# EAGLE design General Switch Board V6 (EAGLE 6.3)
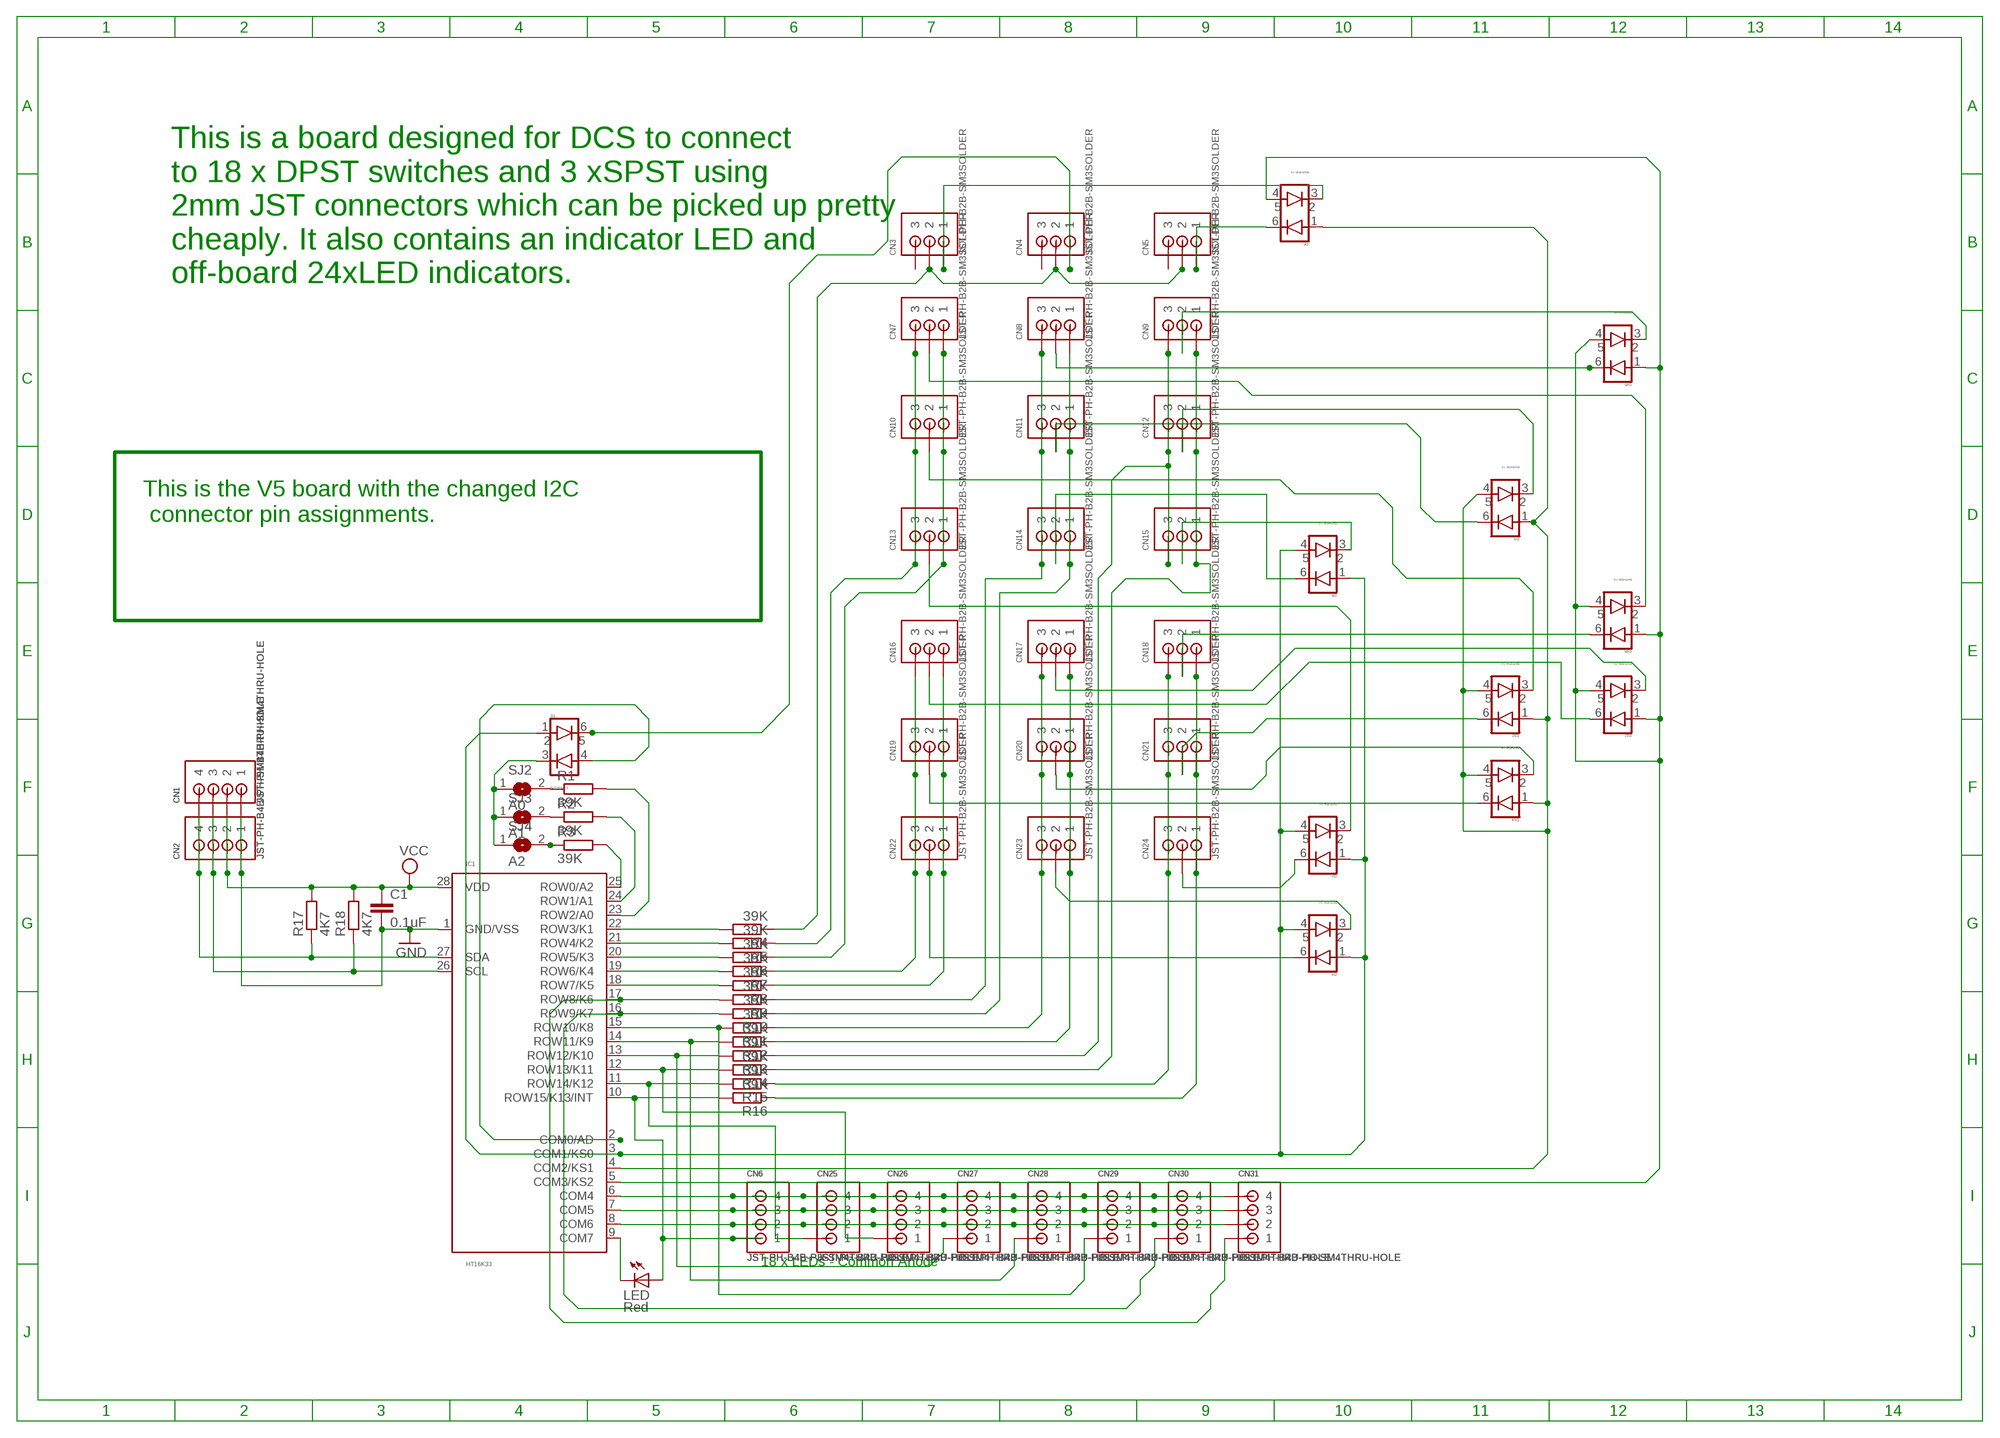
[diagram p0: schematic, sheet 1]

## Parts
C1  0.1uF  C-EUC0805  [C0805]
CN1  JST-PH-B4B-PH-SM4THRU-HOLE  [B4B-PH-SOLDER]
CN2  JST-PH-B4B-PH-SM4THRU-HOLE  [B4B-PH-SOLDER]
CN3  JST-PH-B2B-SM3SOLDER  [B3B-PH-SOLDER]
CN4  JST-PH-B2B-SM3SOLDER  [B3B-PH-SOLDER]
CN5  JST-PH-B2B-SM3SOLDER  [B3B-PH-SOLDER]
CN6  JST-PH-B4B-PH-SM4THRU-HOLE  [B4B-PH-SOLDER]
CN7  JST-PH-B2B-SM3SOLDER  [B3B-PH-SOLDER]
CN8  JST-PH-B2B-SM3SOLDER  [B3B-PH-SOLDER]
CN9  JST-PH-B2B-SM3SOLDER  [B3B-PH-SOLDER]
CN10  JST-PH-B2B-SM3SOLDER  [B3B-PH-SOLDER]
CN11  JST-PH-B2B-SM3SOLDER  [B3B-PH-SOLDER]
CN12  JST-PH-B2B-SM3SOLDER  [B3B-PH-SOLDER]
CN13  JST-PH-B2B-SM3SOLDER  [B3B-PH-SOLDER]
CN14  JST-PH-B2B-SM3SOLDER  [B3B-PH-SOLDER]
CN15  JST-PH-B2B-SM3SOLDER  [B3B-PH-SOLDER]
CN16  JST-PH-B2B-SM3SOLDER  [B3B-PH-SOLDER]
CN17  JST-PH-B2B-SM3SOLDER  [B3B-PH-SOLDER]
CN18  JST-PH-B2B-SM3SOLDER  [B3B-PH-SOLDER]
CN19  JST-PH-B2B-SM3SOLDER  [B3B-PH-SOLDER]
CN20  JST-PH-B2B-SM3SOLDER  [B3B-PH-SOLDER]
CN21  JST-PH-B2B-SM3SOLDER  [B3B-PH-SOLDER]
CN22  JST-PH-B2B-SM3SOLDER  [B3B-PH-SOLDER]
CN23  JST-PH-B2B-SM3SOLDER  [B3B-PH-SOLDER]
CN24  JST-PH-B2B-SM3SOLDER  [B3B-PH-SOLDER]
CN25  JST-PH-B4B-PH-SM4THRU-HOLE  [B4B-PH-SOLDER]
CN26  JST-PH-B4B-PH-SM4THRU-HOLE  [B4B-PH-SOLDER]
CN27  JST-PH-B4B-PH-SM4THRU-HOLE  [B4B-PH-SOLDER]
CN28  JST-PH-B4B-PH-SM4THRU-HOLE  [B4B-PH-SOLDER]
CN29  JST-PH-B4B-PH-SM4THRU-HOLE  [B4B-PH-SOLDER]
CN30  JST-PH-B4B-PH-SM4THRU-HOLE  [B4B-PH-SOLDER]
CN31  JST-PH-B4B-PH-SM4THRU-HOLE  [B4B-PH-SOLDER]
D1  BAT54TW-7-F  [SSOT6]
D2  BAT54TW-7-F  [SSOT6]
D3  BAT54TW-7-F  [SSOT6]
D4  BAT54TW-7-F  [SSOT6]
D5  BAT54TW-7-F  [SSOT6]
D6  BAT54TW-7-F  [SSOT6]
D13  BAT54TW-7-F  [SSOT6]
D14  BAT54TW-7-F  [SSOT6]
D15  BAT54TW-7-F  [SSOT6]
D16  BAT54TW-7-F  [SSOT6]
D17  BAT54TW-7-F  [SSOT6]
IC1  HT16K33  HOLTEK_HT16K33  [SOIC28]
LED  Red  LEDCHIPLED_1206  [CHIPLED_1206]
R1  39K  R-EU_R0805  [R0805]
R2  39K  R-EU_R0805  [R0805]
R3  39K  R-EU_R0805  [R0805]
R4  39K  R-EU_R0805  [R0805]
R5  39K  R-EU_R0805  [R0805]
R6  39K  R-EU_R0805  [R0805]
R7  39K  R-EU_R0805  [R0805]
R8  39K  R-EU_R0805  [R0805]
R9  39K  R-EU_R0805  [R0805]
R10  39K  R-EU_R0805  [R0805]
R11  39K  R-EU_R0805  [R0805]
R12  39K  R-EU_R0805  [R0805]
R13  39K  R-EU_R0805  [R0805]
R14  39K  R-EU_R0805  [R0805]
R15  39K  R-EU_R0805  [R0805]
R16  39K  R-EU_R0805  [R0805]
R17  4K7  R-EU_R0805  [R0805]
R18  4K7  R-EU_R0805  [R0805]
SJ2  A0  SJ  [SJ]
SJ3  A1  SJ  [SJ]
SJ4  A2  SJ  [SJ]

## Nets
GND: C1.2 CN1.P1 CN2.P1 IC1.1(GND/VSS)
N$1: IC1.22(ROW3/K1) R4.2
N$2: CN19.P2 D14.6(C1)
N$3: CN3.P2 CN4.P2 CN5.P2 R4.1
N$4: D1.4(A2) IC1.2(COM0/AD)
N$5: CN25.P1 IC1.11(ROW14/K12) R15.2
N$6: IC1.9(COM7) LED.C
N$8: IC1.21(ROW4/K2) R5.2
N$9: IC1.20(ROW5/K3) R6.2
N$10: CN3.P1 D6.3(C2)
N$11: IC1.19(ROW6/K4) R7.2
N$12: CN5.P1 D6.6(C1)
N$13: CN4.P1 D1.6(C1)
N$14: CN17.P2 D17.3(C2)
N$15: CN9.P1 CN12.P1 CN15.P1 R14.1
N$16: CN1.P3 CN2.P3 IC1.26(SCL) R18.1
N$17: CN24.P2 D2.6(C1)
N$18: CN6.P2 CN25.P2 CN26.P2 CN27.P2 CN28.P2 CN29.P2 CN30.P2 CN31.P2 IC1.8(COM6)
N$19: CN8.P2 D15.6(C1)
N$20: D6.4(A2) D15.1(A1) D15.4(A2) D16.1(A1) D16.4(A2) D17.1(A1) D17.4(A2) IC1.5(COM3/KS2)
N$21: IC1.18(ROW7/K5) R8.2
N$22: CN20.P2 D14.3(C2)
N$23: IC1.24(ROW1/A1) R2.2
N$24: CN15.P2 D5.3(C2)
N$25: IC1.23(ROW2/A0) R1.2
N$26: CN14.P2 D5.6(C1)
N$27: IC1.25(ROW0/A2) R3.2
N$28: CN13.P2 D2.3(C2)
N$29: CN6.P3 CN25.P3 CN26.P3 CN27.P3 CN28.P3 CN29.P3 CN30.P3 CN31.P3 IC1.7(COM5)
N$30: CN21.P2 D13.6(C1)
N$31: CN16.P2 D17.6(C1)
N$32: CN18.P2 D16.6(C1)
N$33: CN10.P2 D13.3(C2)
N$34: CN11.P2 D4.6(C1)
N$35: CN12.P2 D4.3(C2)
N$36: CN22.P2 D3.6(C1)
N$38: CN9.P2 D15.3(C2)
N$39: CN6.P4 CN25.P4 CN26.P4 CN27.P4 CN28.P4 CN29.P4 CN30.P4 CN31.P4 IC1.6(COM4)
N$40: CN18.P3 CN21.P3 CN24.P3 R15.1
N$41: CN7.P2 D16.3(C2)
N$42: CN23.P2 D3.3(C2)
N$44: CN27.P1 IC1.13(ROW12/K10) R13.2
N$45: D1.1(A1) D2.1(A1) D2.4(A2) D3.1(A1) D3.4(A2) D5.1(A1) D5.4(A2) IC1.3(COM1/KS0)
N$47: CN9.P3 CN12.P3 CN15.P3 R13.1
N$49: CN26.P1 IC1.12(ROW13/K11) R14.2
N$50: CN30.P1 IC1.16(ROW9/K7) R10.2
N$51: CN28.P1 IC1.14(ROW11/K9) R12.2
N$52: CN29.P1 IC1.15(ROW10/K8) R11.2
N$53: CN18.P1 CN21.P1 CN24.P1 R16.1
N$54: CN31.P1 IC1.17(ROW8/K6) R9.2
N$55: D4.1(A1) D4.4(A2) D6.1(A1) D13.1(A1) D13.4(A2) D14.1(A1) D14.4(A2) IC1.4(COM2/KS1)
N$59: CN6.P1 IC1.10(ROW15/K13/INT) LED.A R16.2
N$61: CN7.P1 CN10.P1 CN13.P1 R6.1
N$72: R3.1 SJ4.2
N$73: D1.3(C2) SJ2.1 SJ3.1 SJ4.1
N$76: R1.1 SJ2.2
N$77: R2.1 SJ3.2
N$86: CN16.P1 CN19.P1 CN22.P1 R8.1
N$89: CN7.P3 CN10.P3 CN13.P3 R5.1
N$92: CN16.P3 CN19.P3 CN22.P3 R7.1
N$96: CN17.P3 CN20.P3 CN23.P3 R11.1
N$97: CN17.P1 CN20.P1 CN23.P1 R12.1
N$106: CN8.P1 CN11.P1 CN14.P1 R10.1
N$121: CN8.P3 CN11.P3 CN14.P3 R9.1
SDA: CN1.P4 CN2.P4 IC1.27(SDA) R17.1
VCC: C1.1 CN1.P2 CN2.P2 IC1.28(VDD) R17.2 R18.2
Unconnected: CN3.P3 CN4.P3 CN5.P3 D1.2(NC0) D1.5(NC1) D2.2(NC0) D2.5(NC1) D3.2(NC0) D3.5(NC1) D4.2(NC0) D4.5(NC1) D5.2(NC0) D5.5(NC1) D6.2(NC0) D6.5(NC1) D13.2(NC0) D13.5(NC1) D14.2(NC0) D14.5(NC1) D15.2(NC0) D15.5(NC1) D16.2(NC0) D16.5(NC1) D17.2(NC0) D17.5(NC1)

## Notes on the sheet
- This is a board designed for DCS to connect
  to 18 x DPST switches and 3 xSPST using
  2mm JST connectors which can be picked up pretty
  cheaply. It also contains an indicator LED and
  off-board 24xLED indicators.
- This is the V5 board with the changed I2C
   connector pin assignments.
- 18 x LEDs - Common Anode

## Library data of the parts
C1 = rcl:C-EU: CAPACITOR, European symbol
CN1 CN2 CN6 CN25-CN31 = 000_nl2:JST-PH-B4B-PH-SM4: JST PH 4 Pin (2.00")
CN3-CN5 CN7-CN24 = 000_nl2:JST-PH-B2B-SM3: JST PH Connector 2mm Pitch (3 Pin)
D1-D6 D13-D17 = nl2:BAT54TW-7-F
IC1 = 000_nl2:HOLTEK_HT16K33: Holtek HT16K33 RAM Mapping 16*8 LED Controller Driver with keyscan Origianlly tested with the AdaFruit breakout board, the chip is described here <http://www.adafruit.com/datasheets/ht16K33v110.pdf>.
LED = led:LED: LED OSRAM: - CHIPLED LG R971, LG N971, LY N971, LG Q971, LY Q971, LO R971, LY R971 LH N974, LH R974 LS Q976, LO Q976, LY Q976 LO Q996 - Hyper CHIPLED LW Q18S LB Q993, LB Q99A, LB R99A - SideLED LS A670, LO A670, LY A670, LG A670, LP A670 LB A673, LV A673, LT A673, LW A673 LH A674 LY A675 LS A676, LA A676, LO A676, LY A676, LW A676 LS A679, LY A679, LG A679 - Hyper Micro SIDELED® LS Y876, LA Y876, LO Y876, LY Y876 LT Y87S - SmartLED LW L88C, LW L88S LB L89C, LB L89S, LG L890 LS L89K, LO L89K, LY L89K LS L896, LA L896, LO L896, LY L896 - TOPLED LS T670, LO T670, LY T670, LG T670, LP T670 LSG T670, LSP T670, LSY T670, LOP T670, LYG T670 LG T671, LOG T671, LSG T671 LB T673, LV T673, LT T673, LW T673 LH T674 LS T676, LA T676, LO T676, LY T676, LB T676, LH T676, LSB T676, LW T676 LB T67C, LV T67C, LT T67C, LS T67K, LO T67K, LY T67K, LW E67C LS E67B, LA E67B, LO E67B, LY E67B, LB E67C, LV E67C, LT E67C LW T67C LS T679, LY T679, LG T679 LS T770, LO T770, LY T770, LG T770, LP T770 LB T773, LV T773, LT T773, LW T773 LH T774 LS E675, LA E675, LY E675, LS T675 LS T776, LA T776, LO T776, LY T776, LB T776 LHGB T686 LT T68C, LB T68C - Hyper Mini TOPLED® LB M676 - Mini TOPLED Santana® LG M470 LS M47K, LO M47K, LY M47K Source: http://www.osram.convergy.de LUXEON: - LUMILED® LXK2-PW12-R00, LXK2-PW12-S00, LXK2-PW14-U00, LXK2-PW14-V00 LXK2-PM12-R00, LXK2-PM12-S00, LXK2-PM14-U00 LXK2-PE12-Q00, LXK2-PE12-R00, LXK2-PE12-S00, LXK2-PE14-T00, LXK2-PE14-U00 LXK2-PB12-K00, LXK2-PB12-L00, LXK2-PB12-M00, LXK2-PB14-N00, LXK2-PB14-P00, LXK2-PB14-Q00 LXK2-PR12-L00, LXK2-PR12-M00, LXK2-PR14-Q00, LXK2-PR14-R00 LXK2-PD12-Q00, LXK2-PD12-R00, LXK2-PD12-S00 LXK2-PH12-R00, LXK2-PH12-S00 LXK2-PL12-P00, LXK2-PL12-Q00, LXK2-PL12-R00 Source: www.luxeon.com KINGBRIGHT: KA-3528ASYC Source: www.kingbright.com
R1-R16 = resistor:R-EU_: RESISTOR, European symbol
R17 R18 = rcl:R-EU_: RESISTOR, European symbol
SJ2-SJ4 = jumper:SJ: SMD solder JUMPER

## Board
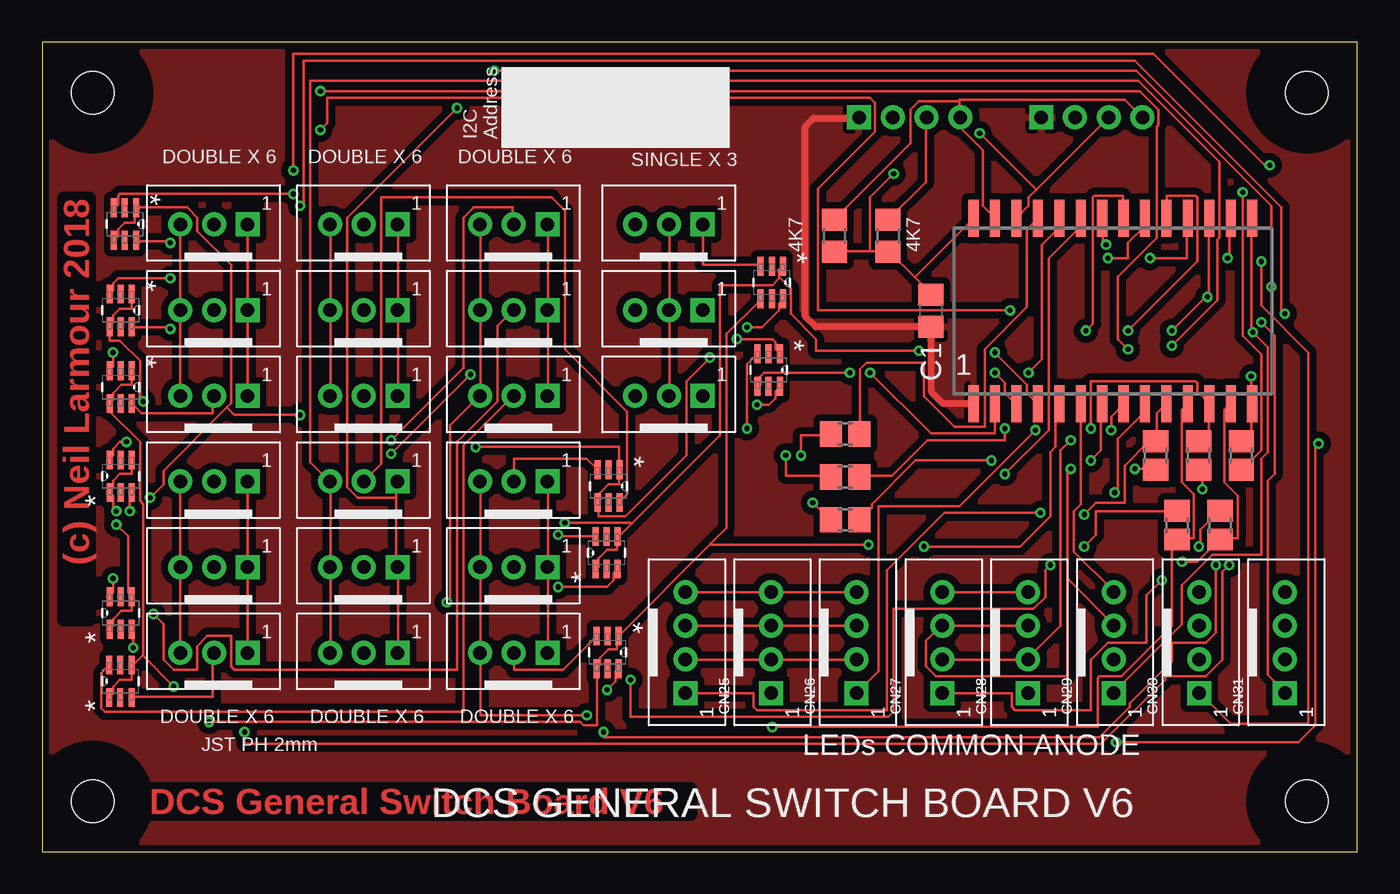
[diagram p1: board, top side]
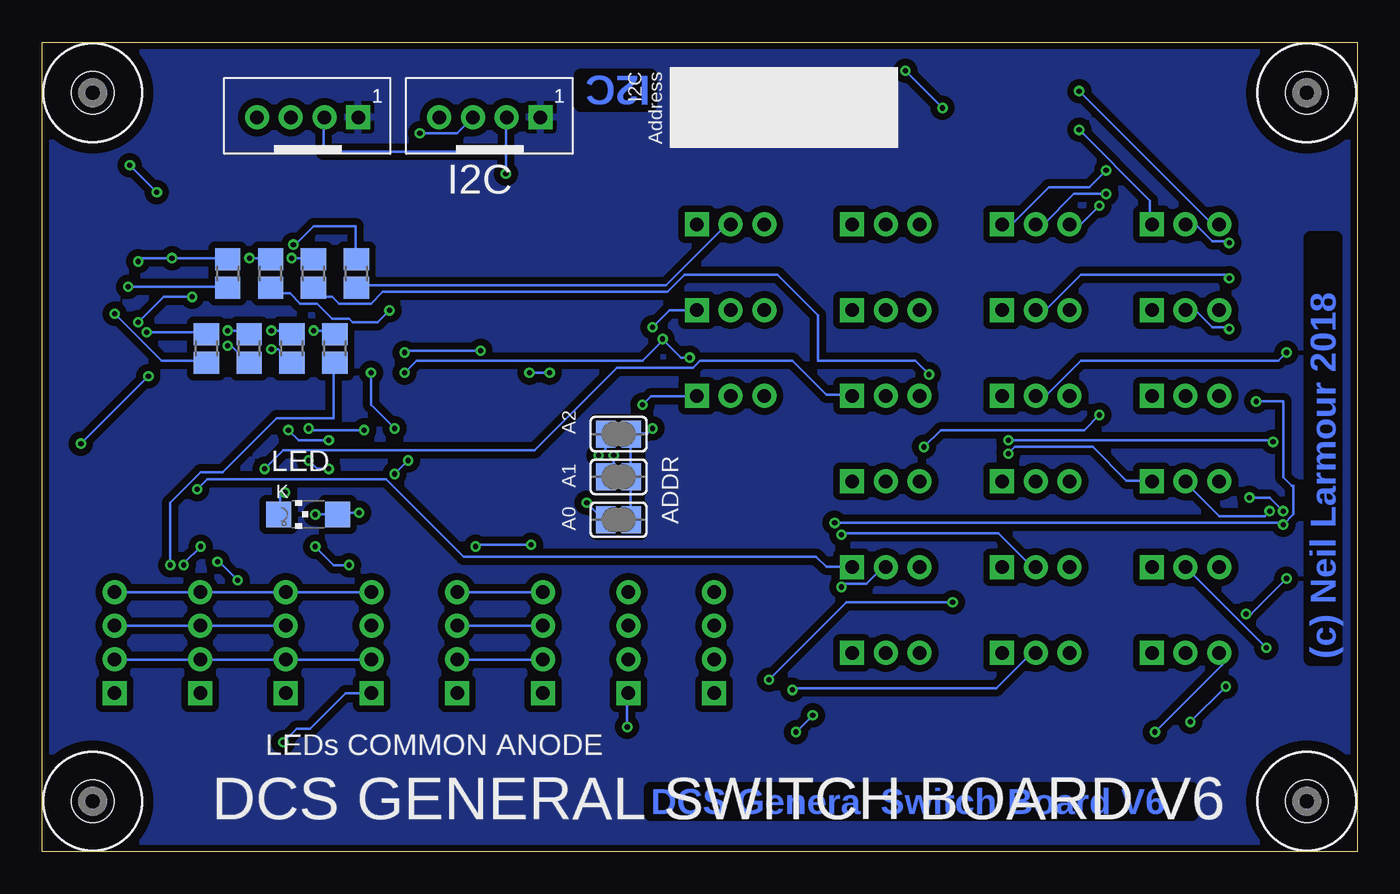
[diagram p2: board, bottom side, seen from below]

Size 78 x 48 mm. Coordinates in mm from the lower left corner, seen from the top.
Outline: 78,0 78,48 0,48 0,0 78,0
Copper layers (1*16): Top 0.035mm / dielectric 1.5mm / Bottom 0.035mm
Design rules "SeeedStudio_2layer_DRU_no_angle_20140221": minimum track width 6mil, minimum drill 12mil, track to track 6mil, track to pad 6mil, pad to pad 6mil, via to via 6mil, smd to smd 0mil, copper to edge 10mil, drill to drill 10mil, minimum pad ring 10mil, minimum via ring 6mil, stop-mask expansion 2mil, vias tented up to drill 100mil, thermal gap 10mil

### Footprints (pad centres in the part's own frame; a part is rotated, then mirrored left to right if it is on the bottom)
C0805 = smd 1.3 x 1.5: 1 -0.95,0; 2 0.95,0
B4B-PH-SOLDER = drill 0.8 pad 1.422 square: P1 -2.98,0.588 | drill 0.8 pad 1.422: P2 -0.98,0.588; P3 1.02,0.588; P4 3.02,0.588
B3B-PH-SOLDER = drill 0.8 pad 1.422 square: P1 -2.98,0.588 | drill 0.8 pad 1.422: P2 -0.98,0.588; P3 1.02,0.588
SSOT6 = smd 1.118 x 0.356: 1 -0.965,0.66; 2 -0.965,0; 3 -0.965,-0.66; 4 0.965,-0.66; 5 0.965,0; 6 0.965,0.66
SOIC28 = smd 0.6 x 2.2: 1 -7.62,-5.5; 2 -6.35,-5.5; 3 -5.08,-5.5; 4 -3.81,-5.5; 5 -2.54,-5.5; 6 -1.27,-5.5; 7 0,-5.5; 8 1.27,-5.5; 9 2.54,-5.5; 10 3.81,-5.5; 11 5.08,-5.5; 12 6.35,-5.5; 13 7.62,-5.5; 14 8.89,-5.5; 15 8.89,5.5; 16 7.62,5.5; 17 6.35,5.5; 18 5.08,5.5; 19 3.81,5.5; 20 2.54,5.5; 21 1.27,5.5; 22 0,5.5; 23 -1.27,5.5; 24 -2.54,5.5; 25 -3.81,5.5; 26 -5.08,5.5; 27 -6.35,5.5; 28 -7.62,5.5
CHIPLED_1206 = smd 1.5 x 1.5: A 0,-1.75; C 0,1.75
R0805 = smd 1.3 x 1.5: 1 -0.85,0; 2 0.85,0
R0805' = smd 1.3 x 1.5: 1 -0.95,0; 2 0.95,0
SJ = smd 1.168 x 1.6: 1 -0.762,0; 2 0.762,0
DRIL-2,5 = hole 2.5: 0,0

### Placement (x,y rotation side)
C1  52.7,32.07 270 top
CN1  51.44,44.13 180 bottom
CN2  62.23,44.13 180 bottom
CN3  36.2,37.78 180 top
CN4  36.2,27.62 180 top
CN5  36.2,32.7 180 top
CN6  38.73,12.38 90 top
CN7  9.21,12.38 180 top
CN8  18.1,12.38 180 top
CN9  26.99,12.38 180 top
CN10  9.21,17.46 180 top
CN11  18.1,17.46 180 top
CN12  26.99,17.46 180 top
CN13  9.21,22.54 180 top
CN14  18.1,22.54 180 top
CN15  26.99,22.54 180 top
CN16  9.21,27.62 180 top
CN17  18.1,27.62 180 top
CN18  26.99,27.62 180 top
CN19  9.21,32.7 180 top
CN20  18.1,32.7 180 top
CN21  26.99,32.7 180 top
CN22  9.21,37.78 180 top
CN23  18.1,37.78 180 top
CN24  26.99,37.78 180 top
CN25  43.81,12.38 90 top
CN26  48.9,12.38 90 top
CN27  53.98,12.38 90 top
CN28  59.05,12.38 90 top
CN29  64.14,12.38 90 top
CN30  69.22,12.38 90 top
CN31  74.3,12.38 90 top
D1  43.09,28.57 270 top
D2  4.66,22.27 90 top
D3  4.91,37.21 270 top
D4  33.47,17.73 90 top
D5  33.59,21.68 270 top
D6  43.27,33.75 270 top
D13  4.66,14.16 90 top
D14  4.66,32.1 270 top
D15  33.53,11.83 270 top
D16  4.64,10.11 90 top
D17  4.66,27.55 270 top
IC1  62.87,32.07 0 top
LED  62.23,20 90 bottom
R1  47.62,19.68 0 top
R2  47.62,22.23 0 top
R3  47.62,24.77 0 top
R4  59.37,34.29 90 bottom
R5  60.64,29.84 90 bottom
R6  61.91,34.29 90 bottom
R7  63.18,29.84 90 bottom
R8  64.45,34.29 90 bottom
R9  65.72,29.84 90 bottom
R10  66.99,34.29 90 bottom
R11  68.26,29.84 90 bottom
R12  71.12,23.5 90 top
R13  69.85,19.37 270 top
R14  68.58,23.5 90 top
R15  67.31,19.37 270 top
R16  66.04,23.5 90 top
R17  4K7  [R0805']  46.99,36.51 270 top
R18  4K7  [R0805']  50.16,36.51 270 top
SJ2  43.81,19.68 180 bottom
SJ3  43.81,22.23 180 bottom
SJ4  43.81,24.77 180 bottom
U$2  [DRIL-2,5]  3,3 270 bottom
U$3  [DRIL-2,5]  75,3 270 bottom
U$4  [DRIL-2,5]  75,45 270 bottom
U$6  [DRIL-2,5]  3,45 270 bottom

### Tracks (layer width: path | path; a pad name or v marks a point on that pad's centre or on a via)
GND
  Top 0.406: IC1.1 53.43,26.57 52.75,27.25 52.75,31.07 C1.2 45.88,31.12 45.25,31.75 45.25,43 45.75,43.5 48.41,43.5 CN1.P1
  pour Top (isolate 0.406, rank 2): 0,0 0,48 78,48 78,0
  pour Bottom (isolate 0.406, rank 2): 78,0 78,48 0,48 0,0
N$1  (via drill 0.3)
  Top 0.152: v63.1,36 62.9,36.2 62.9,37.5 IC1.22
  Bottom 0.152: v63.1,36 63,36 61.9,37.1 59.4,37.1 59.4,35.2 R4.2
N$2  (via drill 0.3)
  Top 0.152: v7.6,31 7.6,31.1 5.4,31.1 D14.6
  Bottom 0.152: v7.6,31 7.7,31.1 8.6,31.1 9.6,32.1 10.1,32.1 CN19.P2
N$3
  Top 0.152: CN4.P2 37.2,27.1 37.2,32.1 CN5.P2 37.2,32.2 37.2,37.1 CN3.P2
  Bottom 0.152: R4.1 59.3,33.5 59.2,33.6 41,33.6 37.5,37.1 37.2,37.1 CN3.P2
N$4  (via drill 0.3)
  Top 0.152: v47.9,28.4 42.8,28.4 42.6,28.2 42.6,27.7 42.5,27.6 D1.4 | v49.1,28.4 52.7,24.8 56.5,24.8 56.5,26.5 IC1.2
  Bottom 0.152: v49.1,28.4 v47.9,28.4
N$5  (via drill 0.3)
  Top 0.152: IC1.11 67.9,26.5 67.6,26.2 67.6,21.9 68.3,21.2 68.3,18.6 67.4,18.6 R15.2 67.3,18.5 67,18.2 67,13.4 64,10.4 62.7,10.4 62.6,10.3 62.6,7.4 v43.3,7.4
  Bottom 0.152: v43.3,7.4 43.3,9.4 CN25.P1
N$6  (via drill 0.3)
  Top 0.152: v63.6,21.3 63.8,21.5 63.8,24.5 65.4,26.1 65.4,26.5 IC1.9
  Bottom 0.152: v63.6,21.3 63.9,21.3 63.9,20.1 LED.C
N$8  (via drill 0.3)
  Top 0.152: v61.9,30.9 62.3,31.3 62.3,38.8 62.4,38.9 64.1,38.9 64.1,37.6 IC1.21
  Bottom 0.152: v61.9,30.9 60.9,30.9 60.7,30.7 R5.2
N$9  (via drill 0.3)
  Top 0.152: v63.2,35.2 64.4,35.2 64.4,36.1 65.4,37.1 65.4,37.5 IC1.20
  Bottom 0.152: v63.2,35.2 62,35.2 R6.2
N$10
  Top 0.152: D6.3 42.6,34.8 39.2,34.8 39.2,37.1 CN3.P1
N$11  (via drill 0.3)
  Top 0.152: v64.4,30.9 68.5,35 68.5,38.8 68.4,38.9 66.7,38.9 66.7,37.6 IC1.19
  Bottom 0.152: v64.4,30.9 63.4,30.9 63.2,30.7 R7.2
N$12  (via drill 0.3)
  Top 0.152: v41.8,31.1 42.7,31.1 43.7,32.1 43.7,32.5 43.9,32.7 D6.6
  Bottom 0.152: v41.8,31.1 40.8,32.1 39.2,32.1 CN5.P1
N$13  (via drill 0.3)
  Top 0.152: v42.4,26.5 43.1,26.5 43.5,26.9 43.5,27.3 43.7,27.5 D1.6
  Bottom 0.152: v42.4,26.5 41.9,27 39.2,27 CN4.P1
N$14  (via drill 0.3)
  Top 0.152: v4.2,29.6 4.2,28.8 4,28.6 D17.3
  Bottom 0.152: v4.2,29.6 4.7,29.1 16.4,29.1 18.4,27.1 19,27.1 CN17.P2
N$15  (via drill 0.3)
  Top 0.152: v68.8,21.5 68.8,22.4 68.6,22.6 R14.1 | CN9.P1 30,11.8 30,16.8 CN12.P1 30,16.9 30,21.9 CN15.P1
  Bottom 0.152: v68.8,21.5 68.2,22.1 57.6,22.1 53,17.5 32.1,17.5 31.5,16.9 30,16.9 CN12.P1
N$16  (via drill 0.3)
  Top 0.152: R18.1 50.2,37.5 52.4,39.7 52.4,43.5 CN1.P3 | 58.95,39.25 63.2,43.5 CN2.P3 | 58.95,39.25 58.5,38.8 58.5,38.3 57.8,37.6 IC1.26 | 58.95,39.25 v55.6,42.6
  Bottom 0.152: CN1.P3 53.4,42.6 v55.6,42.6
N$17  (via drill 0.3)
  Top 0.152: v5,24.3 4.6,24.3 4.2,23.9 4.2,23.5 4,23.3 D2.6 | v20.7,24.4 25,28.7 25,37.6 25.6,38.2 27.9,38.2 27.9,37.2 CN24.P2
  Bottom 0.152: v5,24.3 5.1,24.4 v20.7,24.4
N$18  (via drill 0.3)
  Top 0.152: CN6.P2 38.2,11.4 43.2,11.4 CN25.P2 43.3,11.4 CN26.P2 | v63.4,25 63.4,25.8 64.1,26.5 IC1.8 | v61,24.4 60.4,23.8 60.4,13.4 58.5,11.5 CN28.P2 58.4,11.4 CN27.P2
  Bottom 0.152: CN31.P2 68.7,11.4 CN30.P2 68.6,11.4 63.6,11.4 CN29.P2 63.5,11.4 58.5,11.4 CN28.P2 | v63.4,25 62.8,24.4 v61,24.4 | CN26.P2 48.4,11.4 53.3,11.4 CN27.P2
N$19  (via drill 0.3)
  Top 0.152: v33.5,9.6 34,10.1 34,10.7 34.1,10.8 D15.6
  Bottom 0.152: v33.5,9.6 33.4,9.7 21.4,9.7 19.4,11.7 19.1,11.7 CN8.P2
N$20  (via drill 0.3)
  Top 0.152: D16.1 4,9.2 4.2,9.4 4.2,9.8 4.6,10.2 5.3,10.2 5.3,11 D16.4 5.4,11.1 5.95,11.65 | D17.1 5.3,28.5 5.3,27.7 4.7,27.7 4.2,27.2 4.2,26.8 4,26.6 D17.4 4,26.5 4,26.1 5.8,24.3 5.8,20.8 6,20.6 6,11.7 5.95,11.65 | 39.65,18.25 D15.1 34.1,12.7 34.1,12 33.6,12 33.1,11.5 33.1,11.1 32.9,10.9 D15.4 32.9,10.8 32.9,7.5 32.1,7.5 31.9,7.7 v9.9,7.7 | 39.65,18.25 40.6,19.2 40.6,30.7 42.6,32.7 D6.4 | v52.3,18.1 58,18.1 59.8,19.9 59.8,23.7 60.1,24 60.1,26.3 60.3,26.5 IC1.5 | v49,18.2 39.7,18.2 39.65,18.25 | v7.8,9.8 5.95,11.65
  Bottom 0.152: v52.3,18.1 52.2,18.2 v49,18.2 | v9.9,7.7 v7.8,9.8
N$21  (via drill 0.3)
  Top 0.152: v65.7,35.2 67.9,35.2 67.9,37.5 IC1.18
  Bottom 0.152: v65.7,35.2 64.5,35.2 R8.2
N$22  (via drill 0.3)
  Top 0.152: v7.6,34 4.5,34 4.2,33.7 4.2,33.3 4,33.1 D14.3
  Bottom 0.152: v7.6,34 7.8,34.2 16.4,34.2 18.4,32.2 19,32.2 CN20.P2
N$23  (via drill 0.3)
  Top 0.152: v57.1,25.1 57.1,24.4 52.5,24.4 50.4,22.3 48.5,22.3 R2.2 | v58.5,28.4 59.3,29.2 59.3,36 60.3,37 60.3,37.5 IC1.24
  Bottom 0.152: v57.1,25.1 58.5,26.5 v58.5,28.4
N$24
  Top 0.152: D5.3 32.9,22.7 32.3,23.3 28,23.3 28,22 CN15.P2
N$25  (via drill 0.3)
  Top 0.152: v56.3,23.2 51.8,23.2 49.2,20.6 49.2,20.4 48.5,19.7 R1.2 | v57.1,22.4 59.7,25 59.7,35.2 61.5,37 61.5,37.5 IC1.23
  Bottom 0.152: v57.1,22.4 v56.3,23.2
N$26
  Top 0.152: D5.6 34.3,20.8 34.7,21.2 34.7,26.1 31,29.8 31,38 30.2,38.8 20.1,38.8 20.1,23 19.1,22 CN14.P2
N$27
  Top 0.152: R3.2 48.5,24.8 48.5,28.6 48.9,29 52.3,29 52.3,27 54.1,25.2 55.9,25.2 55.9,29.8 58.4,32.3 58.4,36.9 59,37.5 IC1.25
N$28  (via drill 0.3)
  Top 0.152: v5.2,20.2 5.2,21.2 5.3,21.3 D2.3
  Bottom 0.152: v5.2,20.2 5.5,19.9 8.2,19.9 10.2,21.9 CN13.P2
N$29  (via drill 0.3)
  Top 0.152: CN6.P3 38.2,13.4 43.2,13.4 CN25.P3 43.3,13.4 CN26.P3 | CN28.P3 58.4,13.4 CN27.P3 53.3,13.4 52.4,12.5 52.4,11 53,10.4 60.8,10.4 60.8,16.1 60.85,16.15 | v62.2,23.2 62.8,23.8 62.8,26.5 IC1.7 | v61,22.7 60.8,22.5 60.8,16.2 60.85,16.15 | 60.85,16.15 63.5,13.5 CN29.P3
  Bottom 0.152: CN31.P3 68.7,13.4 CN30.P3 68.6,13.4 63.6,13.4 CN29.P3 | v62.2,23.2 61.7,22.7 v61,22.7 | CN26.P3 48.4,13.4 53.3,13.4 CN27.P3
N$30  (via drill 0.3)
  Top 0.152: v4.2,16.2 4.2,15.4 4,15.2 D13.6 | v6.6,14.1 7.2,13.5 7.2,11.4 7.8,10.8 9.2,10.8 9.2,12.2 9.8,12.8 11.2,12.8 11.2,11 11.4,10.8 24.6,10.8 24.6,24.3 27,26.7 27,31.2 27.9,32.1 CN21.P2
  Bottom 0.152: v4.2,16.2 6.3,14.1 v6.6,14.1
N$31
  Top 0.152: D17.6 5.4,26.5 5.9,26 10.1,26 10.1,27 CN16.P2
N$32
  Top 0.152: D16.6 3.9,11 3.5,10.6 3.5,8.5 3.7,8.3 25,8.3 25,24.1 27.9,27 CN18.P2
N$33  (via drill 0.3)
  Top 0.152: v5.4,12.1 5.4,13.1 D13.3
  Bottom 0.152: v5.4,12.1 10.1,16.8 CN10.P2
N$34  (via drill 0.3)
  Top 0.152: v30.6,18.8 30.6,18.7 D4.6
  Bottom 0.152: v30.6,18.8 30.5,18.9 21.3,18.9 19.3,16.9 19.1,16.9 CN11.P2
N$35  (via drill 0.3)
  Top 0.152: v30.6,15.7 33.5,15.7 33.9,16.1 33.9,16.5 34.1,16.7 D4.3
  Bottom 0.152: v30.6,15.7 30.4,15.9 29.1,15.9 28.2,16.8 28,16.8 CN12.P2
N$36  (via drill 0.3)
  Top 0.152: v7.6,36.1 7.6,36.2 5.6,36.2 D3.6
  Bottom 0.152: v7.6,36.1 7.7,36.2 8.6,36.2 9.5,37.1 10.1,37.1 CN22.P2
N$38
  Top 0.152: D15.3 32.8,12.7 30.9,10.8 28,10.8 28,11.7 CN9.P2
N$39
  Top 0.152: CN6.P4 38.2,15.4 43.2,15.4 CN25.P4 43.3,15.4 CN26.P4 | CN27.P4 58.4,15.4 CN28.P4 | IC1.6 61.6,26.5 61.6,20.6 61.2,20.2 61.2,17.8 63.5,15.5 CN29.P4
  Bottom 0.152: CN31.P4 68.7,15.4 CN30.P4 68.6,15.4 63.6,15.4 CN29.P4 63.5,15.4 58.5,15.4 CN28.P4 | CN26.P4 48.4,15.4 53.3,15.4 CN27.P4
N$40  (via drill 0.3)
  Top 0.152: CN24.P3 26,37.1 26,32.2 CN21.P3 26,32.1 26,27.1 CN18.P3 25.9,27 24.2,25.3 24.2,15 v24,14.8 | v61.8,18.1 62.5,18.8 62.5,20.2 67.3,20.2 R15.1 | v59.8,17 59.5,16.7 59.5,15.1 58.8,14.4 50.5,14.4 50.5,8.3 50.2,8 34.9,8 v34.9,10.2
  Bottom 0.152: v61.8,18.1 60.7,17 v59.8,17 | v34.9,10.2 30.3,14.8 v24,14.8
N$41
  Top 0.152: D16.3 5.4,9.2 10.1,9.2 10.1,11.7 CN7.P2
N$42  (via drill 0.3)
  Top 0.152: v14.9,39 4.6,39 4.5,38.9 4.5,38.4 4.3,38.2 D3.3
  Bottom 0.152: v14.9,39 16.8,39 18.6,37.2 19,37.2 CN23.P2
N$44  (via drill 0.3)
  Top 0.152: IC1.13 70.4,26.5 70.1,26.2 70.1,21.9 70.9,21.1 70.9,18.6 69.9,18.6 R13.2 69.8,18.5 68.5,17.2 v67.6,17.2 | v66.4,16.1 65.5,15.2 65.5,12.4 63.2,12.4 62.2,11.4 62.2,8.4 57.7,8.4 57.5,8.6 57.5,9.4 CN27.P1
  Bottom 0.152: v66.4,16.1 67.5,17.2 v67.6,17.2
N$45  (via drill 0.3)
  Top 0.152: D2.4 5.3,23.2 5.3,22.4 4.6,22.4 4.2,22 4.2,21.6 4,21.4 D2.1 4.2,21.1 4.2,20.4 v4.4,20.2 | D3.4 4.3,36.3 4.5,36.5 4.5,36.9 4.9,37.3 5.5,37.3 5.5,38.1 D3.1 5.6,38.2 8.6,38.2 9.2,37.6 9.2,36.8 11.2,34.8 11.2,26.6 10.95,26.35 | v6.4,21 7.2,21.8 7.2,22.6 10.95,26.35 | v41.2,30.4 43.3,30.4 43.5,30.2 43.5,29.8 43.7,29.6 D1.1 | v39.6,29.3 38.2,27.9 38.2,23.5 34.6,19.9 33,19.9 33,20.7 D5.4 33,20.8 33.1,20.9 33.1,21.3 33.6,21.8 34.2,21.8 34.2,22.6 D5.1 34.2,22.7 34.2,24 v25.7,24 | v56.5,28.4 57.1,27.8 57.1,27.2 57.7,26.6 IC1.3 | 10.95,26.35 11.4,25.9 v15.3,25.9
  Bottom 0.152: v4.4,20.2 5.2,21 v6.4,21 | v39.6,29.3 40.1,29.3 v41.2,30.4 41.2,30.3 42.4,29.1 55.8,29.1 v56.5,28.4 | v15.3,25.9 16.2,25 24.7,25 v25.7,24
N$47  (via drill 0.3)
  Top 0.152: CN15.P3 26,21.9 26,16.9 CN12.P3 26,16.8 26,11.8 CN9.P3 26,11.7 26,8.1 v32.3,8.1 | v68.6,18.1 68.7,18.2 68.7,19.1 69.8,20.2 R13.1 | v69.6,17 69.6,13 69,12.4 67,12.4 67,11.3 64.5,8.8 64.5,8.6 62.7,6.8 33.3,6.8 v33.3,7.1
  Bottom 0.152: v68.6,18.1 69.6,17.1 v69.6,17 | v32.3,8.1 v33.3,7.1
N$49  (via drill 0.3)
  Top 0.152: R14.2 68.6,24.4 69.2,25 69.2,26.5 IC1.12 69.2,26.6 68.5,27.3 68.5,27.8 68.4,27.9 62.2,27.9 v62.2,25.1 | v58.9,25 54.4,20.5 49.6,20.5 49.6,10.7 48.4,9.5 CN26.P1
  Bottom 0.152: v62.2,25.1 62.1,25 v58.9,25
N$50  (via drill 0.3)
  Top 0.152: v70.3,35.2 70.4,35.3 70.4,37.5 IC1.16 | v72.3,35 72.3,32.4 75.1,29.6 75.1,7.6 70.5,7.6 68.7,9.4 CN30.P1
  Bottom 0.152: R10.2 67,35.2 v70.3,35.2 72.1,35.2 v72.3,35
N$51  (via drill 0.3)
  Top 0.152: R12.2 71.2,24.4 71.7,24.9 71.7,26.5 IC1.14 71.7,26.6 v71.7,28.2 | v75.7,24.2 75.5,24 75.5,7.5 74.5,6.5 v63.7,6.5
  Bottom 0.152: v75.7,24.2 v71.7,28.2 | v63.7,6.5 62.9,7.3 62.1,7.3 60,9.4 58.5,9.4 CN28.P1
N$52  (via drill 0.3)
  Top 0.152: IC1.15 71.7,37.5 71.7,30.9 v71.8,30.8 72.7,29.9 72.7,23.7 72.3,23.3 72.3,17.6 69.4,17.6 67.6,15.8 67.6,13.5 63.6,9.5 CN29.P1
  Bottom 0.152: v71.8,30.8 68.4,30.8 68.3,30.7 R11.2
N$53  (via drill 0.3)
  Top 0.152: CN24.P1 30,37.1 30,32.2 CN21.P1 30,32.1 30,27.1 CN18.P1 | v64.8,22.7 66,22.7 R16.1
  Bottom 0.152: v64.8,22.7 63.7,23.8 48.8,23.8 43.9,28.7 39.4,28.7 39,29.1 33.5,29.1 31.5,27.1 30,27.1 CN18.P1
N$54  (via drill 0.3)
  Top 0.152: 69.05,32.95 69.2,33.1 69.2,37.5 IC1.17 | 69.05,32.95 v67,30.9 | v72.3,31.4 73.1,30.6 73.1,22.4 72.7,22 72.7,10.5 73.7,9.5 CN31.P1 | v69.1,32.9 69.05,32.95
  Bottom 0.152: v67,30.9 66,30.9 65.8,30.7 R9.2 | v72.3,31.4 70.8,32.9 v69.1,32.9
N$55  (via drill 0.3)
  Top 0.152: D13.1 4.2,13.4 4.2,13.8 4.7,14.3 5.3,14.3 5.3,15.1 D13.4 5.3,15.2 5.1,15.4 5.1,18.7 v4.4,19.4 | D14.1 5.3,33 5.3,32.2 4.6,32.2 4.2,31.8 4.2,31.4 4,31.2 D14.4 4,31.1 4,30.3 4.6,30.3 5.8,29.1 5.8,26.9 v6,26.7 | D4.1 32.9,16.8 33,16.9 33,17.4 33.5,17.9 34.1,17.9 34.1,18.6 D4.4 34.2,18.7 34.95,19.45 | 43.7,34.1 43.7,34 43.3,33.6 40.2,33.6 40.2,24.7 34.95,19.45 | 43.7,34.1 43.7,34.5 43.9,34.7 D6.1 | v56.5,29.6 58.4,27.7 58.4,27.2 59,26.6 IC1.4 | v52,29.7 45.9,29.7 45.9,30.4 44.4,31.9 44.4,33.4 43.7,34.1 | v31,19.5 34.9,19.5 34.95,19.45
  Bottom 0.152: v6,26.7 4.4,26.7 4.4,22.2 3.9,21.7 3.8,21.7 3.8,20 v4.4,19.4 4.4,19.5 v31,19.5 | v56.5,29.6 56.4,29.7 v52,29.7
N$59  (via drill 0.3)
  Top 0.152: v61.8,20 62.5,20.7 64.2,20.7 64.2,22.9 65.6,24.3 66,24.3 R16.2 66.1,24.4 66.1,26 66.6,26.5 IC1.10 | v59.2,20.1 53.5,20.1 50.1,16.7 50.1,8.4 42.4,8.4 42.2,8.6 42.2,9.4 38.2,9.4 CN6.P1
  Bottom 0.152: v61.8,20 60.5,20 LED.A 60.4,20.1 v59.2,20.1
N$61  (via drill 0.3)
  Top 0.152: CN7.P1 12.2,16.8 CN10.P1 12.2,16.9 12.2,21.9 CN13.P1 | v20.7,23.6 v25.4,28.3
  Bottom 0.152: v25.4,28.3 26.2,29.1 32,29.1 32,31.8 34.4,34.2 39.9,34.2 40.9,33.2 57.8,33.2 58.5,32.5 60.4,32.5 60.8,32.9 61.4,32.9 61.9,33.4 R6.1 | v20.7,23.6 20.3,24 15.7,24 13.7,22 12.2,22 CN13.P1
N$72  (via drill 0.3)
  Top 0.152: 46.8,24.8 R3.1 46.7,24.7 45,24.7 v45,23.5
  Bottom 0.152: v45,23.5 44.6,23.9 44.6,24.7 SJ4.2
N$73  (via drill 0.3)
  Top 0.152: v41.8,25.1 41.8,28.9 42.4,29.5 D1.3
  Bottom 0.152: SJ2.1 43.1,19.7 43.1,22.2 SJ3.1 43.1,22.3 43.1,24.7 SJ4.1 43,24.8 42.1,24.8 v41.8,25.1
N$76  (via drill 0.3)
  Top 0.152: v45.7,20.7 46.7,19.7 R1.1
  Bottom 0.152: v45.7,20.7 44.7,19.7 44.6,19.7 SJ2.2
N$77  (via drill 0.3)
  Top 0.152: v44.1,23.5 44.1,22.3 46.7,22.3 R2.1
  Bottom 0.152: v44.1,23.5 44.1,22.3 44.5,22.3 SJ3.2
N$86  (via drill 0.3)
  Top 0.152: CN16.P1 12.2,27.1 12.2,32.1 CN19.P1 12.2,32.2 12.2,37.1 CN22.P1 | v57.4,32.1 46,32.1 46,39.3 49.4,42.7 49.4,44.4 49.1,44.7 16.9,44.7 16.9,43.2 v16.5,42.8
  Bottom 0.152: v57.4,32.1 58.1,31.4 59.6,31.4 59.8,31.6 60.8,31.6 61.7,32.5 62.7,32.5 63.3,33.1 64.1,33.1 64.4,33.4 R8.1 | v16.5,42.8 12.3,38.6 12.3,37.2 CN22.P1
N$89  (via drill 0.3)
  Top 0.152: CN13.P3 8.2,21.9 8.2,16.9 CN10.P3 8.2,16.8 CN7.P3 | v70.4,17 70,16.6 70,11.4 69,10.4 66.6,10.4 66.6,10.2 62.8,6.4 12,6.4 v12,7.1
  Bottom 0.152: v70.4,17 70.4,20.7 68.6,22.5 67.3,22.5 64.1,25.7 60.7,25.7 60.7,28.9 R5.1 | v12,7.1 8,11.1 8,11.7 8.1,11.7 CN7.P3
N$92  (via drill 0.3)
  Top 0.152: CN16.P3 8.2,27.1 8.2,32.1 CN19.P3 8.2,32.2 8.2,37.1 CN22.P3 | v64.4,29.8 63.8,30.4 63.8,34.1 66.1,36.4 66.1,43 66.2,43.1 66.2,44 65.1,45.1 v16.5,45.1
  Bottom 0.152: v64.4,29.8 64,29.8 63.2,29 R7.1 | v16.5,45.1 8.6,37.2 CN22.P3
N$96  (via drill 0.3)
  Top 0.152: CN17.P3 17.1,27.1 17.1,32.1 CN20.P3 17.1,32.2 17.1,37.1 CN23.P3 | v73.7,31.9 73.5,32.1 73.5,38.2 64.8,46.9 15.5,46.9 15.5,38.5 v15.3,38.3
  Bottom 0.152: v73.7,31.9 70.9,29.1 68.4,29.1 68.3,29 R11.1 | v15.3,38.3 16.4,37.2 17,37.2 CN23.P3
N$97  (via drill 0.3)
  Top 0.152: CN17.P1 21.1,27.1 21.1,32.1 CN20.P1 21.1,32.2 21.1,37.1 CN23.P1 | v71.2,39.1 71.2,30.6 72.3,29.5 72.3,23.8 71.2,22.7 R12.1 | v72.8,40.7 72.5,40.7 65.9,47.3 14.9,47.3 v14.9,40.4
  Bottom 0.152: v72.8,40.7 v71.2,39.1 | v14.9,40.4 15.9,39.4 18.3,39.4 20.5,37.2 21,37.2 CN23.P1
N$106  (via drill 0.3)
  Top 0.152: CN8.P1 21.1,11.8 21.1,16.8 CN11.P1 21,16.9 21,21 | v72.9,33.5 72.9,38.3 64.9,46.3 v26.8,46.3 | v24.6,44.1 18.1,37.6 18.1,21.6 18.7,21 21,21 | 21,21 21,21.9 CN14.P1
  Bottom 0.152: v72.9,33.5 67,33.5 R10.1 | v24.6,44.1 v26.8,46.3
N$121  (via drill 0.3)
  Top 0.152: CN8.P3 17.1,11.8 17.1,16.8 CN11.P3 17.1,16.9 17.1,21.9 CN14.P3 17,22 15.9,23.1 15.9,45.7 65,45.7 69.8,40.9 69.8,36.4 69.7,36.3 69.7,32.7 v67,30
  Bottom 0.152: v67,30 66.8,30 65.8,29 R9.1
SDA
  Top 0.152: 54.4,44.5 52,44.5 51.5,44 51.5,42 47,37.5 R17.1 | 54.4,44.5 54.4,43.6 CN1.P4 54.5,43.5 54.5,42.9 55.8,41.6 55.8,38.3 56.5,37.6 IC1.27 | 54.4,44.5 54.4,44.6 64.2,44.6 65.2,43.6 CN2.P4
VCC  (via drill 0.3)
  Top 0.152: 49.1,35.6 50.1,35.6 R18.2 50.2,35.6 51.75,34.05 | 49.1,35.6 47,35.6 R17.2 | 51.75,34.05 52.7,33.1 C1.1 | 51.75,34.05 55.2,37.5 IC1.28 | v50.5,40.2 49.1,38.8 49.1,35.6
  Bottom 0.152: v50.5,40.2 50.5,41.5 | 50.5,41.5 50.5,43.5 CN1.P2 | 50.5,41.5 61.3,41.5 61.3,43.5 CN2.P2

### Text on the board
Top: (c) Neil Larmour 2018 | DCS General Switch Board V6
Bottom: I2C | (c) Neil Larmour 2018 | DCS General Switch Board V6
tNames: I2C / Address | DOUBLE X 6 | DOUBLE X 6 | DOUBLE X 6 | SINGLE X 3 | 4K7 | 4K7 | DOUBLE X 6 | DOUBLE X 6 | DOUBLE X 6 | JST PH 2mm | LEDs COMMON ANODE | DCS GENERAL SWITCH BOARD V6
bNames: I2C / Address | I2C | A2 | ADDR | A1 | K | A0 | LEDs COMMON ANODE | DCS GENERAL SWITCH BOARD V6